# EAGLE design mcu_module (EAGLE 9.5.1)
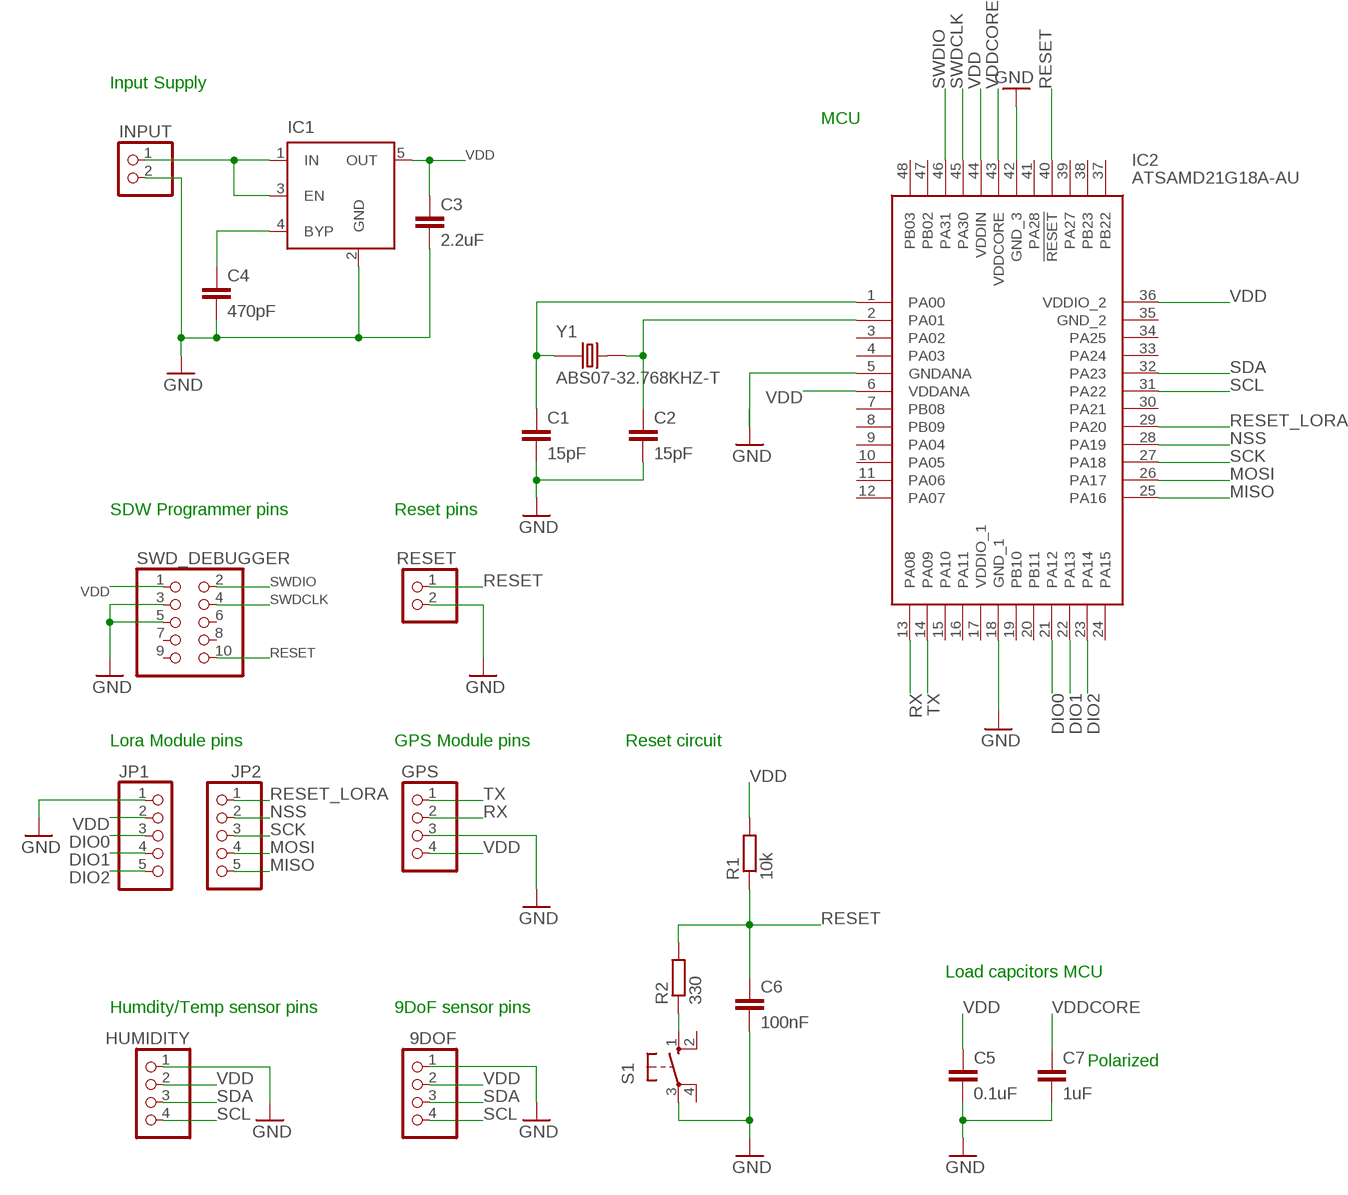
[diagram p0: schematic, sheet 1]

## Parts
9DOF  PINHD-1X4  [1X04]
C1  15pF  C-EUC0805  [C0805]
C2  15pF  C-EUC0805  [C0805]
C3  2.2uF  C-EUC0805  [C0805]
C4  470pF  C-EUC0805  [C0805]
C5  0.1uF  C-EUC0805  [C0805]
C6  100nF  C-EUC0805  [C0805]
C7  1uF  C-EUC0805  [C0805]
GPS  PINHD-1X4  [1X04]
HUMIDITY  PINHD-1X4  [1X04]
IC1  MIC5219XX  [SOT23-5]
IC2  ATSAMD21G18A-AU  [QFP50P900X900X120-48N]
INPUT  PINHD-1X2  [1X02]
JP1  PINHD-1X5  [1X05]
JP2  PINHD-1X5  [1X05]
R1  10k  R-EU_R0805  [R0805]
R2  330  R-EU_R0805  [R0805]
RESET  PINHD-1X2  [1X02]
S1  10-XX  [B3F-10XX]
SWD_DEBUGGER  PINHD-2X5  [2X05]
Y1  ABS07-32.768KHZ-T  [XTAL_ABS07-32.768KHZ-T]

## Nets
BYP: C4.1 IC1.4(BYP)
DIO0: IC2.21(PA12) JP1.3
DIO1: IC2.22(PA13) JP1.4
DIO2: IC2.23(PA14) JP1.5
GND: 9DOF.1 C1.2 C2.2 C3.2 C4.2 C5.2 C6.2 C7.2 GPS.3 HUMIDITY.1 IC1.2(GND) IC2.5(GNDANA) IC2.18(GND_1) IC2.42(GND_3) INPUT.2 JP1.1 RESET.2 S1.3(P) SWD_DEBUGGER.3 SWD_DEBUGGER.5
INPUT: IC1.1(IN) IC1.3(EN) INPUT.1
MISO: IC2.25(PA16) JP2.5
MOSI: IC2.26(PA17) JP2.4
N$1: C1.1 IC2.1(PA00) Y1.1
N$2: C2.1 IC2.2(PA01) Y1.2
N$3: R2.1 S1.1(S)
NSS: IC2.28(PA19) JP2.2
RESET: C6.1 IC2.40(!RESET) R1.1 R2.2 RESET.1 SWD_DEBUGGER.10
RESET_LORA: IC2.29(PA20) JP2.1
RX: GPS.2 IC2.13(PA08)
SCK: IC2.27(PA18) JP2.3
SCL: 9DOF.4 HUMIDITY.4 IC2.31(PA22)
SDA: 9DOF.3 HUMIDITY.3 IC2.32(PA23)
SWDCLK: IC2.45(PA30) SWD_DEBUGGER.4
SWDIO: IC2.46(PA31) SWD_DEBUGGER.2
TX: GPS.1 IC2.14(PA09)
VDD: 9DOF.2 C3.1 C5.1 GPS.4 HUMIDITY.2 IC1.5(OUT) IC2.6(VDDANA) IC2.36(VDDIO_2) IC2.44(VDDIN) JP1.2 R1.2 SWD_DEBUGGER.1
VDDCORE: C7.1 IC2.43(VDDCORE)
Unconnected: IC2.3(PA02) IC2.4(PA03) IC2.7(PB08) IC2.8(PB09) IC2.9(PA04) IC2.10(PA05) IC2.11(PA06) IC2.12(PA07) IC2.15(PA10) IC2.16(PA11) IC2.17(VDDIO_1) IC2.19(PB10) IC2.20(PB11) IC2.24(PA15) IC2.30(PA21) IC2.33(PA24) IC2.34(PA25) IC2.35(GND_2) IC2.37(PB22) IC2.38(PB23) IC2.39(PA27) IC2.41(PA28) IC2.47(PB02) IC2.48(PB03) S1.2(S1) S1.4(P1) SWD_DEBUGGER.6 SWD_DEBUGGER.7 SWD_DEBUGGER.8 SWD_DEBUGGER.9

## Notes on the sheet
- Input Supply
- MCU
- SDW Programmer pins | Reset pins
- Lora Module pins | GPS Module pins | Reset circuit
- Load capcitors MCU
- Humdity/Temp sensor pins | 9DoF sensor pins
- Polarized

## Library data of the parts
9DOF GPS HUMIDITY = pinhead:PINHD-1X4: PIN HEADER
C1-C7 = rcl:C-EU: CAPACITOR, European symbol; SPICEPREFIX: C
IC1 = v-reg-micrel:MIC5219XX: VOLTAGE REGULATOR; OC_FARNELL: unknown; OC_NEWARK: unknown
IC2 = ATSAMD21G18A-AU:ATSAMD21G18A-AU: ATMEL - ATSAMD21G18A-AU - MCU, 32BIT, CORTEX-M0+, 48MHZ, TQFP-48 Source: Datasheet <http://www.farnell.com/datasheets/1807566.pdf>; DESCRIPTION: ATMEL - ATSAMD21G18A-AU - MCU, 32BIT, CORTEX-M0+, 48MHZ, TQFP-48; HEIGHT: 1.2mm; MANUFACTURER_NAME: Microchip; MANUFACTURER_PART_NUMBER: ATSAMD21G18A-AU; MOUSER_PART_NUMBER: 556-ATSAMD21G18A-AU; MOUSER_PRICE-STOCK: https://www.mouser.com/Search/Refine.aspx?Keyword=556-ATSAMD21G18A-AU; RS_PART_NUMBER: 1773799P; RS_PRICE-STOCK: http://uk.rs-online.com/web/p/products/1773799P
INPUT RESET = pinhead:PINHD-1X2: PIN HEADER
JP1 JP2 = pinhead:PINHD-1X5: PIN HEADER
R1 R2 = rcl:R-EU_: RESISTOR, European symbol; SPICEPREFIX: R
S1 = switch-omron:10-XX: OMRON SWITCH; MPN: B3F-1000; OC_FARNELL: 176432; OC_NEWARK: 36M3542
SWD_DEBUGGER = pinhead:PINHD-2X5: PIN HEADER
Y1 = ABS07-32.768KHZ-T:ABS07-32.768KHZ-T: ABS07 Series 32.768 kHz ±20 ppm 12.5 pF -40 to +85 °C SMT Low Profile Crystal; AVAILABILITY: Unavailable; DESCRIPTION: ABS07 Series 32.768 kHz ±20 ppm 12.5 pF -40 to +85 °C SMT Low Profile Crystal; MF: Abracon; MP: ABS07-32.768KHZ-T; PACKAGE: SMD-2 Abracon LLC; PRICE: None

## Board
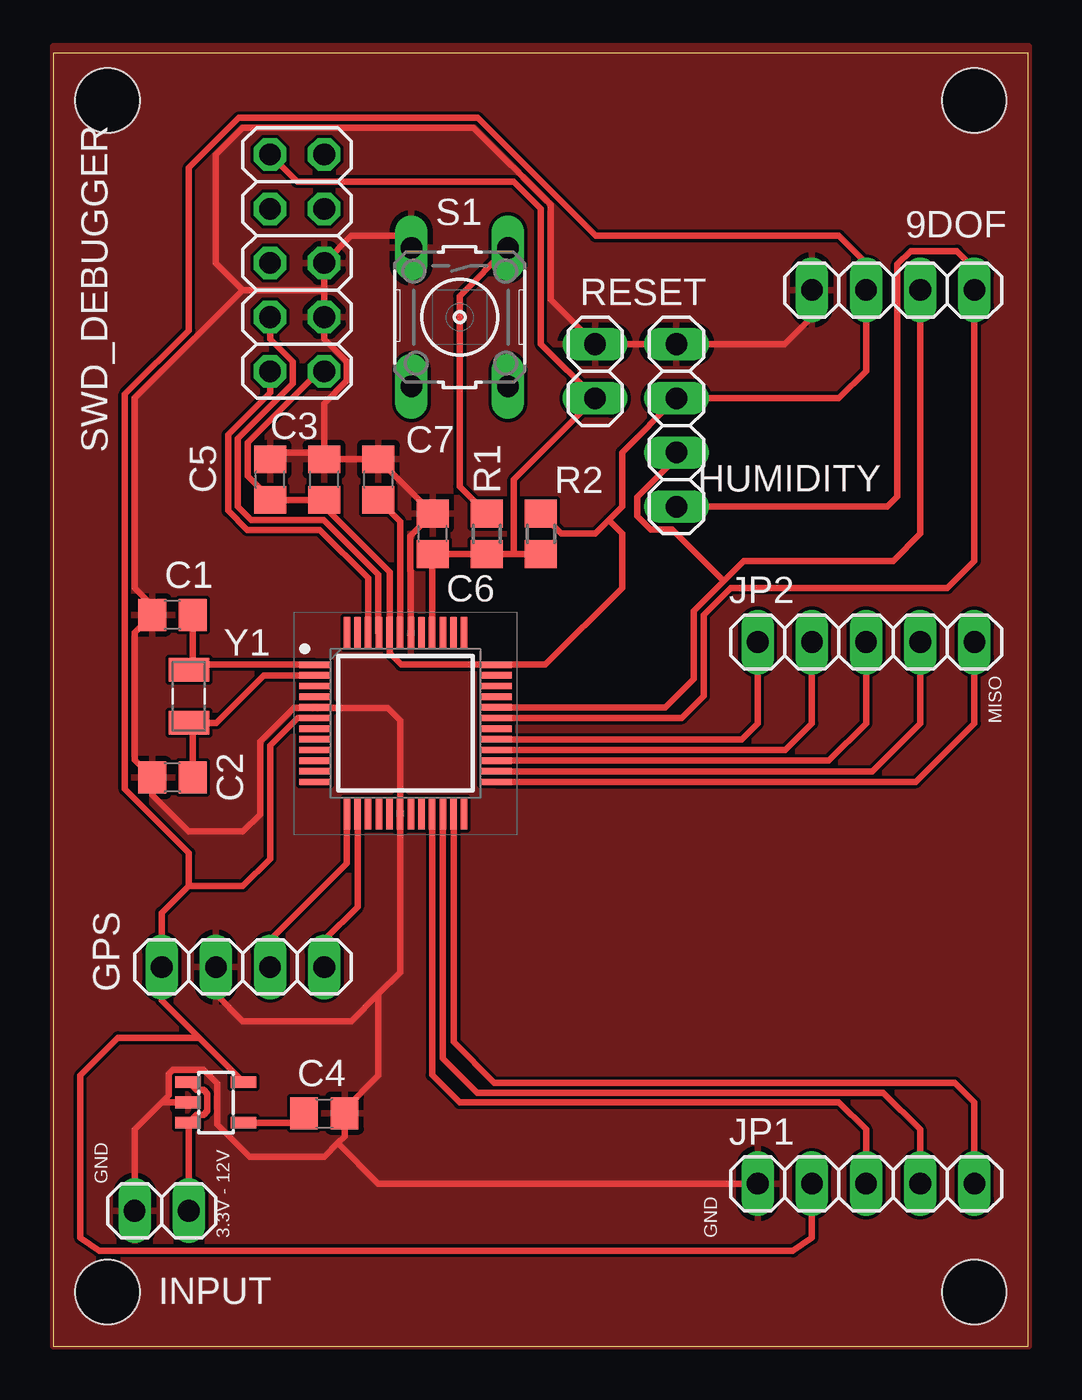
[diagram p1: board, top side]

Size 45.7 x 60.63 mm. Coordinates in mm from the lower left corner, seen from the top.
Outline: 0,0 45.7,0 45.7,60.63 0,60.63 0,0
Copper layers (1*16): Top 0.035mm / dielectric 1.5mm / Bottom 0.035mm
Design rules "default *": minimum track width 6mil, minimum drill 0.35mm, track to track 6mil, track to pad 6mil, pad to pad 6mil, via to via 6mil, smd to smd 6mil, copper to edge 0mil, drill to drill 6mil, minimum pad ring 10mil, minimum via ring 8mil, stop-mask expansion 4mil, vias tented up to drill 0mil, thermal gap 10mil
Holes 3 mm at 43.18,58.42 2.54,58.42 2.54,2.54 43.18,2.54

### Footprints (pad centres in the part's own frame; a part is rotated, then mirrored left to right if it is on the bottom)
1X04 = drill 1.016 long: 1 -3.81,0; 2 -1.27,0; 3 1.27,0; 4 3.81,0
C0805 = smd 1.3 x 1.5: 1 -0.95,0; 2 0.95,0
SOT23-5 = smd 0.55 x 1.2: 1 -0.95,-1.3; 2 0,-1.3; 3 0.95,-1.3; 4 0.95,1.3; 5 -0.95,1.3
QFP50P900X900X120-48N = smd 1.475 x 0.3: 1 -4.238,2.75; 2 -4.238,2.25; 3 -4.238,1.75; 4 -4.238,1.25; 5 -4.238,0.75; 6 -4.238,0.25; 7 -4.238,-0.25; 8 -4.238,-0.75; 9 -4.238,-1.25; 10 -4.238,-1.75; 11 -4.238,-2.25; 12 -4.238,-2.75; 25 4.238,-2.75; 26 4.238,-2.25; 27 4.238,-1.75; 28 4.238,-1.25; 29 4.238,-0.75; 30 4.238,-0.25; 31 4.238,0.25; 32 4.238,0.75; 33 4.238,1.25; 34 4.238,1.75; 35 4.238,2.25; 36 4.238,2.75 | smd 0.3 x 1.475: 13 -2.75,-4.238; 14 -2.25,-4.238; 15 -1.75,-4.238; 16 -1.25,-4.238; 17 -0.75,-4.238; 18 -0.25,-4.238; 19 0.25,-4.238; 20 0.75,-4.238; 21 1.25,-4.238; 22 1.75,-4.238; 23 2.25,-4.238; 24 2.75,-4.238; 37 2.75,4.238; 38 2.25,4.238; 39 1.75,4.238; 40 1.25,4.238; 41 0.75,4.238; 42 0.25,4.238; 43 -0.25,4.238; 44 -0.75,4.238; 45 -1.25,4.238; 46 -1.75,4.238; 47 -2.25,4.238; 48 -2.75,4.238
1X02 = drill 1.016 long: 1 -1.27,0; 2 1.27,0
1X05 = drill 1.016 long: 1 -5.08,0; 2 -2.54,0; 3 0,0; 4 2.54,0; 5 5.08,0
R0805 = smd 1.3 x 1.5: 1 -0.95,0; 2 0.95,0
B3F-10XX = drill 1.016 long: 1 -3.251,2.261; 2 3.251,2.261; 3 -3.251,-2.261; 4 3.251,-2.261
2X05 = drill 1.016 octagon: 1 -5.08,-1.27; 2 -5.08,1.27; 3 -2.54,-1.27; 4 -2.54,1.27; 5 0,-1.27; 6 0,1.27; 7 2.54,-1.27; 8 2.54,1.27; 9 5.08,-1.27; 10 5.08,1.27
XTAL_ABS07-32.768KHZ-T = smd 1.1 x 1.9: 1 -1.25,0; 2 1.25,0

### Placement (x,y rotation side)
9DOF  39.37,49.53 0 top
C1  5.59,34.29 180 top
C2  5.59,26.67 180 top
C3  12.7,40.64 90 top
C4  12.7,10.92 0 top
C5  10.16,40.64 90 top
C6  17.78,38.1 90 top
C7  15.24,40.64 90 top
GPS  8.89,17.78 180 top
HUMIDITY  29.21,43.18 270 top
IC1  7.62,11.43 270 top
IC2  16.51,29.21 0 top
INPUT  5.08,6.35 180 top
JP1  38.1,7.62 0 top
JP2  38.1,33.02 0 top
R1  22.86,38.1 90 top
R2  20.32,38.1 270 top
RESET  25.4,45.72 90 top
S1  19.05,48.26 270 top
SWD_DEBUGGER  11.43,50.8 90 top
Y1  6.35,30.48 270 top

### Tracks (layer width: path | path; a pad name or v marks a point on that pad's centre or on a via)
BYP
  Top 0.305: IC1.4 11.31,10.48 C4.1
DIO0
  Top 0.305: IC2.21 17.76,12.72 19.05,11.43 36.83,11.43 38.1,10.16 JP1.3
DIO1
  Top 0.305: IC2.22 18.26,13.49 19.86,11.89 38.91,11.89 40.64,10.16 JP1.4
DIO2
  Top 0.305: IC2.23 18.76,14.26 20.68,12.34 42.27,12.34 43.18,11.43 JP1.5
GND
  Top 0.305: 15.24,16.51 16.26,17.53 IC2.18 16.26,29.33 15.67,29.92 12.32,29.92 IC2.5 12.23,29.92 11.26,29.92 9.7,28.36 9.7,24.94 8.89,24.13 6.35,24.13 4.64,25.84 C2.2 3.81,27.5 3.81,33.46 C1.2 4.64,34.73 3.81,35.56 3.81,44.45 8.89,49.53 | 15.24,16.51 13.97,15.24 8.89,15.24 7.62,16.51 GPS.3 | INPUT.2 3.81,10.16 5.08,11.43 | IC1.2 5.08,11.43 | 12.7,49.53 SWD_DEBUGGER.5 13.97,52.07 16.23,52.07 S1.3 | 12.7,49.53 SWD_DEBUGGER.3 12.7,47.23 13.77,46.16 13.77,45.28 12.7,44.21 12.7,41.91 | IC2.42 16.76,36.34 16.73,36.37 16.73,37.99 C6.2 C7.2 13.02,41.59 12.7,41.91 | 9DOF.1 35.56,48.26 34.29,46.99 HUMIDITY.1 RESET.2 23.32,49.07 23.32,53.53 19.7,57.15 8.89,57.15 7.62,55.88 7.62,50.8 8.89,49.53 | C3.2 12.7,41.91 | 8.89,49.53 12.7,49.53 | 15.24,16.51 15.24,12.7 13.65,11.11 C4.2 13.65,9.84 13.34,9.53 | 5.08,11.43 5.41,11.77 5.41,12.78 5.59,12.96 7.05,12.96 7.68,12.32 7.68,10.41 9.2,8.89 12.7,8.89 13.34,9.53 | C5.2 10.48,41.91 12.7,41.91 | JP1.1 15.24,7.62 13.34,9.53
  pour Top: 0,60.96 0,0 45.72,0 45.72,60.96
INPUT
  Top 0.305: INPUT.1 6.35,10.45 IC1.3 6.69,10.85 7.05,10.85 7.23,11.03 7.23,11.83 7.05,12.01 6.69,12.01 IC1.1
MISO
  Top 0.305: IC2.25 40.43,26.46 43.18,29.21 JP2.5
MOSI
  Top 0.305: IC2.26 38.39,26.96 40.64,29.21 JP2.4
N$1
  Top 0.305: IC2.1 6.58,31.96 6.54,31.92 | Y1.1 6.54,31.92 | C1.1 6.54,31.92
N$2
  Top 0.305: IC2.2 9.87,31.46 7.64,29.23 Y1.2 6.54,29.04 C2.1
N$3
  Top 0.305: R2.1 19.05,40.32 19.05,49.25 S1.1
NSS
  Top 0.305: IC2.28 34.31,27.96 35.56,29.21 JP2.2
RESET
  Top 0.305: IC2.40 17.76,37.13 C6.1 R2.2 21.59,37.15 | R1.1 21.59,37.15 | 21.59,37.15 21.59,40.64 RESET.1 22.86,46.99 22.86,53.34 21.59,54.61 11.43,54.61 SWD_DEBUGGER.10
RESET_LORA
  Top 0.305: IC2.29 32.27,28.46 33.02,29.21 JP2.1
RX
  Top 0.305: IC2.13 13.76,22.65 10.16,19.05 GPS.2
SCK
  Top 0.305: IC2.27 36.35,27.46 38.1,29.21 JP2.3
SCL
  Top 0.305: IC2.31 29.46,29.46 30.48,30.48 30.48,34.29 31.75,35.56 41.91,35.56 43.18,36.83 9DOF.4 43.18,50.53 42.35,51.36 40.2,51.36 39.57,50.73 39.57,39.84 39.1,39.37 HUMIDITY.4
SDA
  Top 0.305: IC2.32 28.69,29.96 30.02,31.29 30.02,34.48 31.43,35.88 | 31.43,35.88 32.37,36.83 39.37,36.83 40.64,38.1 9DOF.3 | HUMIDITY.3 29.21,41.64 27.38,39.81 27.38,38.93 28.01,38.3 29.01,38.3 31.43,35.88
SWDCLK
  Top 0.305: SWD_DEBUGGER.4 10.16,47.23 11.23,46.16 11.23,45.13 8.65,42.56 8.65,39.37 9.28,38.73 12.69,38.73 15.24,36.18 15.24,33.47 IC2.45
SWDIO
  Top 0.305: IC2.46 14.76,36.02 12.5,38.28 9.09,38.28 8.19,39.18 8.19,42.74 10.16,44.71 SWD_DEBUGGER.2
TX
  Top 0.305: IC2.14 14.26,20.61 12.7,19.05 GPS.1
VDD
  Top 0.305: SWD_DEBUGGER.1 12.46,45.72 9.11,42.37 9.11,40.81 10.16,39.76 C5.1 C3.1 12.7,39.37 15.76,36.31 IC2.44 15.76,32.5 16.3,31.96 IC2.36 23.07,31.96 26.67,35.56 26.67,38.1 26.04,38.73 | R1.2 23.81,38.1 25.4,38.1 26.04,38.73 | 26.04,38.73 26.67,39.37 26.67,41.91 HUMIDITY.2 36.83,44.45 38.1,45.72 9DOF.2 38.1,50.8 36.83,52.07 25.42,52.07 19.89,57.61 8.7,57.61 6.35,55.26 6.35,47.64 3.35,44.64 3.35,26.12 6.35,23.13 6.35,21.59 | 6.35,21.59 5.08,20.32 GPS.4 5.08,16.22 6.84,14.46 | 6.35,21.59 8.89,21.59 10.16,22.86 10.16,28.17 11.45,29.46 IC2.6 | IC1.5 6.84,14.46 | JP1.2 35.56,5.08 34.67,4.47 2.16,4.47 1.27,5.08 1.27,12.7 3.03,14.46 6.84,14.46
VDDCORE
  Top 0.305: C7.1 16.26,38.67 IC2.43

### Text on the board
tNames: MISO | GND | 3.3V - 12V | GND